# EAGLE design Atari 2600 PP (EAGLE 9.6.2)
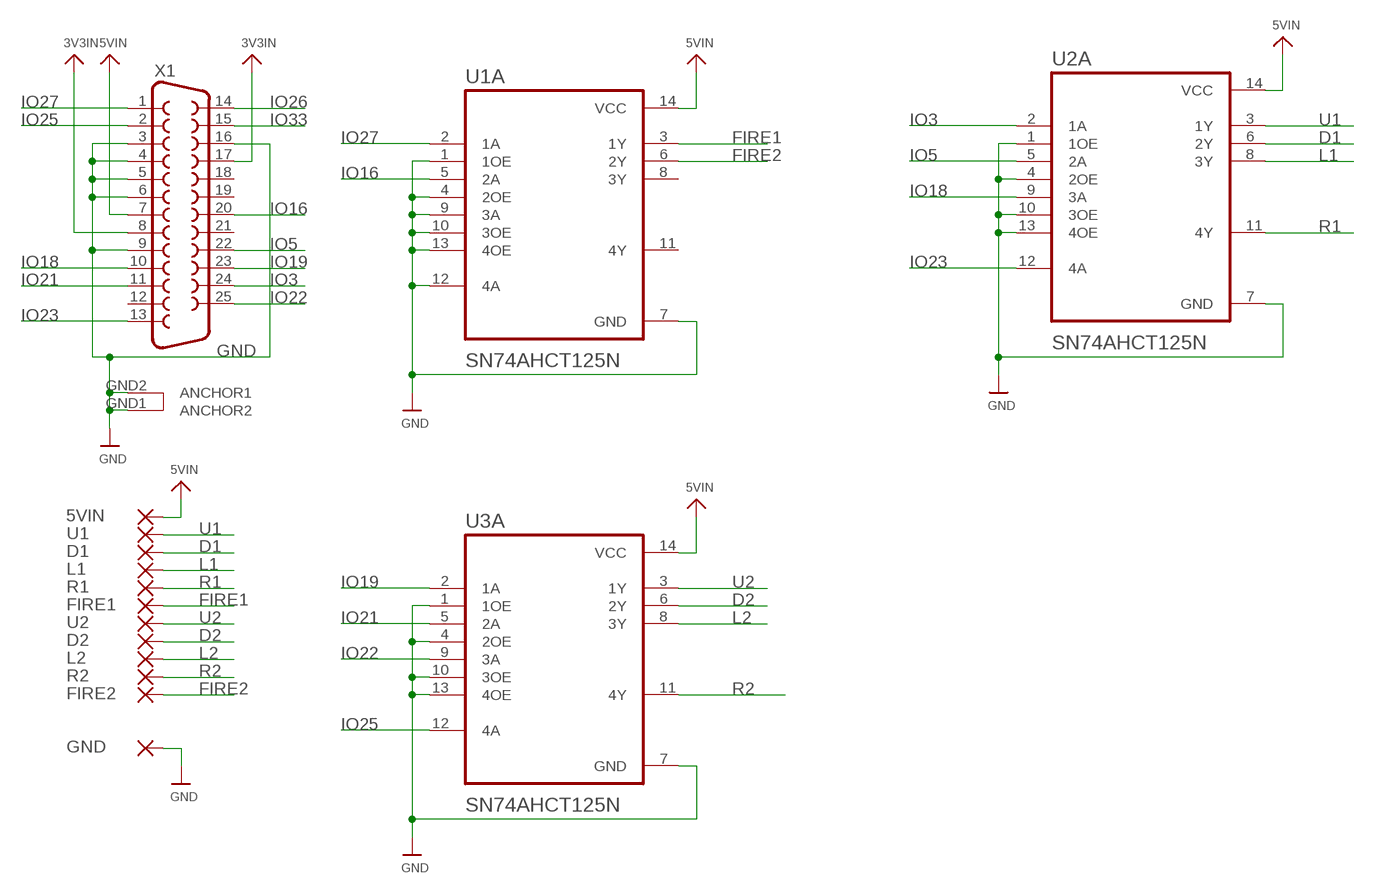
[diagram p0: schematic, sheet 1]

## Parts
5VIN  SMD5  [SMD2,54-5,08]
D1  SMD5  [SMD2,54-5,08]
D2  SMD5  [SMD2,54-5,08]
FIRE1  SMD5  [SMD2,54-5,08]
FIRE2  SMD5  [SMD2,54-5,08]
GND  SMD5  [SMD2,54-5,08]
L1  SMD5  [SMD2,54-5,08]
L2  SMD5  [SMD2,54-5,08]
R1  SMD5  [SMD2,54-5,08]
R2  SMD5  [SMD2,54-5,08]
U1  SMD5  [SMD2,54-5,08]
U1A  SN74AHCT125N  [DIP794W45P254L1969H508Q14]
U2  SMD5  [SMD2,54-5,08]
U2A  SN74AHCT125N  [DIP794W45P254L1969H508Q14]
U3A  SN74AHCT125N  [DIP794W45P254L1969H508Q14]
X1  DB25_FEMALEHP  [F25HP]

## Nets
3V3IN: X1.8 X1.17
5VIN: 5VIN.1(P) U1A.14(VCC) U2A.14(VCC) U3A.14(VCC) X1.7
D1: D1.1(P) U2A.6(2Y)
D2: D2.1(P) U3A.6(2Y)
FIRE1: FIRE1.1(P) U1A.3(1Y)
FIRE2: FIRE2.1(P) U1A.6(2Y)
GND: GND.1(P) U1A.1(1OE) U1A.4(2OE) U1A.7(GND) U1A.9(3A) U1A.10(3OE) U1A.12(4A) U1A.13(4OE) U2A.1(1OE) U2A.4(2OE) U2A.7(GND) U2A.10(3OE) U2A.13(4OE) U3A.1(1OE) U3A.4(2OE) U3A.7(GND) U3A.10(3OE) U3A.13(4OE) X1.3 X1.4 X1.5 X1.6 X1.9 X1.16 X1.GND1(ANCHOR2) X1.GND2(ANCHOR1)
IO3: U2A.2(1A) X1.24
IO5: U2A.5(2A) X1.22
IO16: U1A.5(2A) X1.20
IO18: U2A.9(3A) X1.10
IO19: U3A.2(1A) X1.23
IO21: U3A.5(2A) X1.11
IO22: U3A.9(3A) X1.25
IO23: U2A.12(4A) X1.13
IO25: U3A.12(4A) X1.2
IO26: X1.14
IO27: U1A.2(1A) X1.1
IO33: X1.15
L1: L1.1(P) U2A.8(3Y)
L2: L2.1(P) U3A.8(3Y)
R1: R1.1(P) U2A.11(4Y)
R2: R2.1(P) U3A.11(4Y)
U1: U1.1(P) U2A.3(1Y)
U2: U2.1(P) U3A.3(1Y)
Unconnected: U1A.8(3Y) U1A.11(4Y) X1.12 X1.18 X1.19 X1.21

## Library data of the parts
5VIN D1 D2 FIRE1 FIRE2 GND L1 L2 R1 R2 U1 U2 = wirepad:SMD5: SMD PAD
U1A U2A U3A = SN74AHCT125N:SN74AHCT125N: None Check prices <https://pricing.snapeda.com/parts/SN74AHCT125N/Texas%20Instruments/view-part?ref=eda>; AVAILABILITY: In Stock; DESCRIPTION: Quadruple Bus Buffer Gates With 3-State Outputs 14-PDIP -40 to 125; MF: Texas Instruments; MP: SN74AHCT125N; PACKAGE: PDIP-14 Texas Instruments; PRICE: None; PURCHASE-URL: https://pricing.snapeda.com/search/part/SN74AHCT125N/?ref=eda
X1 = SparkFun-Retired:DB25_FEMALE: 25 Pin male connector. PCB edge mount for regular PCB thicknesses. This connector will connect directly to the back of a PC parallel port or through a normal DB25 extension cable (M/F). SKU: PRT-08287

## Board
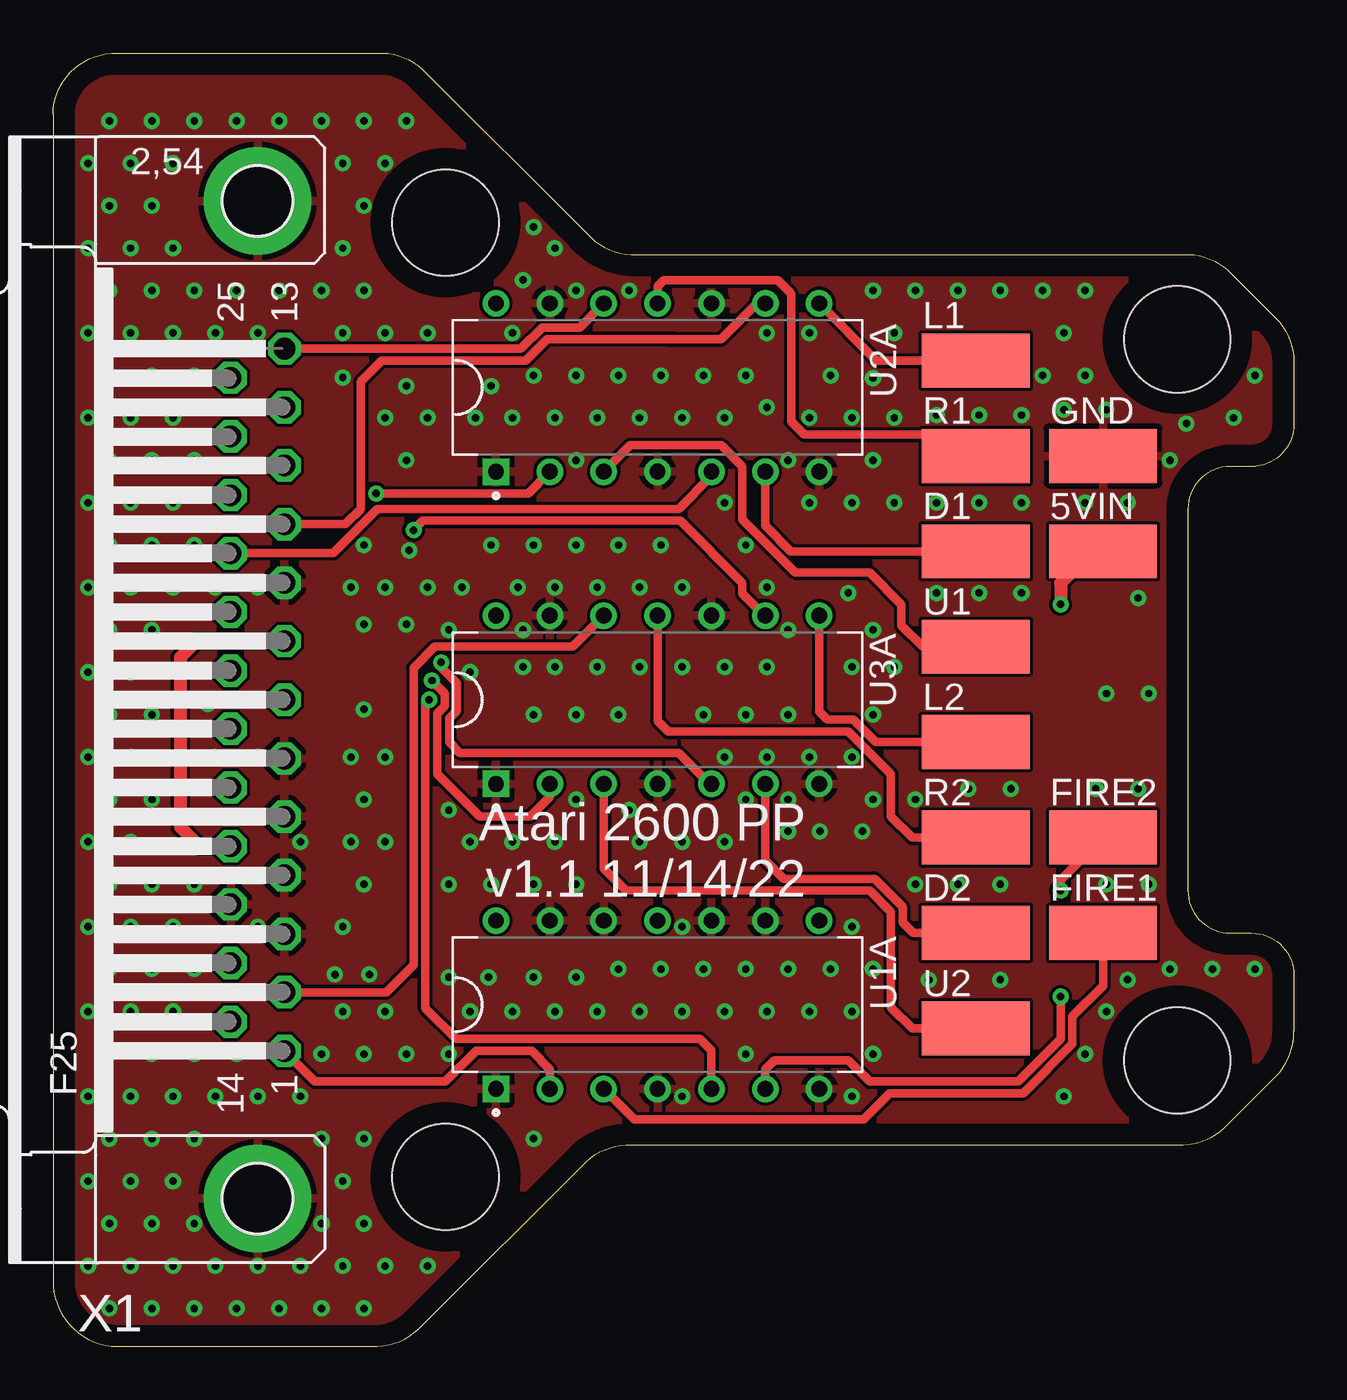
[diagram p1: board, top side]
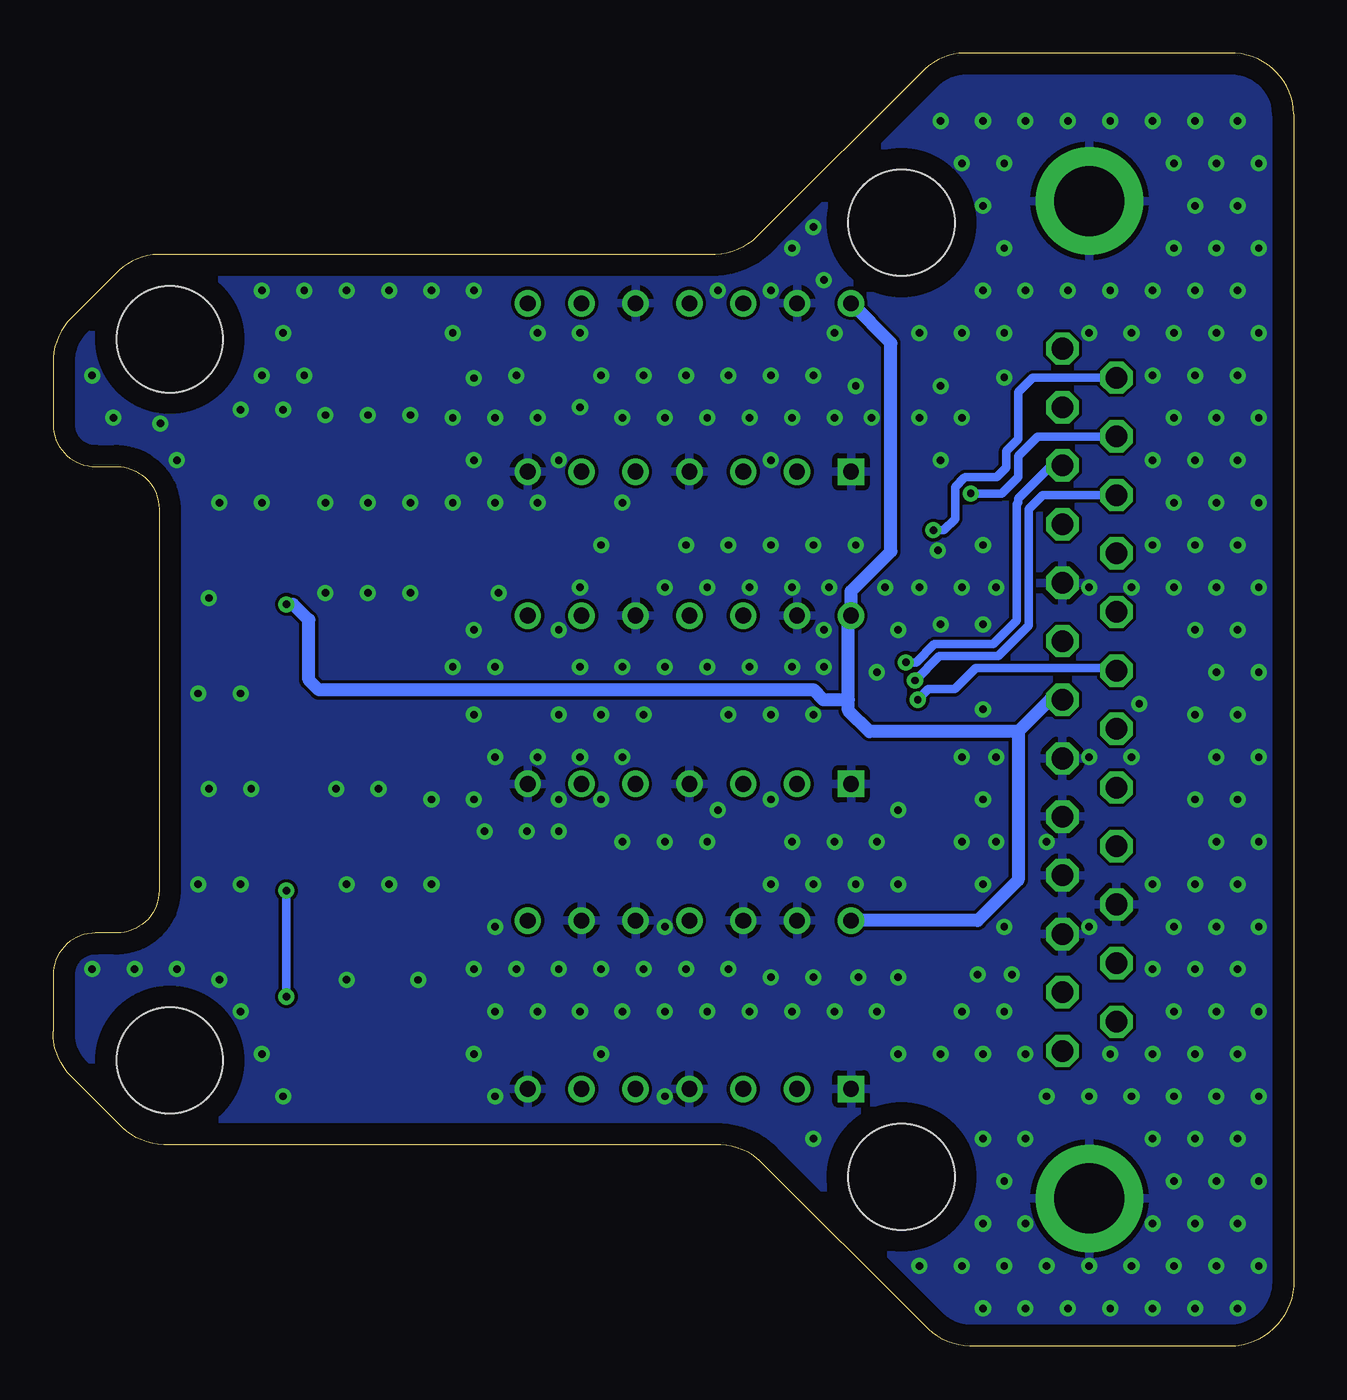
[diagram p2: board, bottom side, seen from below]

Size 58.5 x 61 mm. Coordinates in mm from the lower left corner, seen from the top.
Outline: 0,58.12 0,3.12 arc90 3.03,0 15.29,0 arc45 17.41,1 25.15,8.74 arc-45 27.27,9.5 53.29,9.5 arc45 55.41,10.5 57.65,12.74 arc45 58.5,14.86 58.5,17.5 arc90 56.5,19.5 55.5,19.5 arc-90 53.5,21.5 53.5,39.5 arc-90 55.5,41.5 56.5,41.5 arc90 58.5,43.5 58.5,46.38 arc45 57.65,48.5 55.41,50.74 arc45 53.29,51.5 27.27,51.5 arc-45 25.15,52.5 17.41,60.24 arc45 15.29,61 3.03,61 arc90 0,58.12
Copper layers (1*16): Top 0.035mm / dielectric 1.5mm / Bottom 0.035mm
Design rules "default": minimum track width 6mil, minimum drill 0.35mm, track to track 6mil, track to pad 6mil, pad to pad 6mil, via to via 6mil, smd to smd 6mil, copper to edge 40mil, drill to drill 6mil, minimum pad ring 10mil, minimum via ring 8mil, stop-mask expansion 4mil, vias tented up to drill 0.5mm, thermal gap 10mil
Holes 5 mm at 53,13.5 53,47.5 18.5,53 18.5,8

### Footprints (pad centres in the part's own frame; a part is rotated, then mirrored left to right if it is on the bottom)
SMD2,54-5,08 = smd 2.54 x 5.08: 1 0,0
DIP794W45P254L1969H508Q14 = drill 0.74 pad 1.14 square: 1 -3.97,7.62 | drill 0.74 pad 1.14: 2 -3.97,5.08; 3 -3.97,2.54; 4 -3.97,0; 5 -3.97,-2.54; 6 -3.97,-5.08; 7 -3.97,-7.62; 8 3.97,-7.62; 9 3.97,-5.08; 10 3.97,-2.54; 11 3.97,0; 12 3.97,2.54; 13 3.97,5.08; 14 3.97,7.62
F25HP = drill 1.016 octagon: 1 -16.561,-1.27; 2 -13.792,-1.27; 3 -11.049,-1.27; 4 -8.28,-1.27; 5 -5.512,-1.27; 6 -2.769,-1.27; 7 0,-1.27; 8 2.769,-1.27; 9 5.512,-1.27; 10 8.28,-1.27; 11 11.049,-1.27; 12 13.792,-1.27; 13 16.561,-1.27; 14 -15.189,1.27; 15 -12.421,1.27; 16 -9.652,1.27; 17 -6.909,1.27; 18 -4.14,1.27; 19 -1.372,1.27; 20 1.372,1.27; 21 4.14,1.27; 22 6.909,1.27; 23 9.652,1.27; 24 12.421,1.27; 25 15.189,1.27 | drill 3.302 pad 5.08: GND1 -23.52,0; GND2 23.52,0

### Placement (x,y rotation side)
5VIN  49.5,37.5 270 top
D1  43.5,37.5 270 top
D2  43.5,19.5 270 top
FIRE1  49.5,19.5 270 top
FIRE2  49.5,24 270 top
GND  49.5,42 270 top
L1  43.5,46.5 270 top
L2  43.5,28.5 270 top
R1  43.5,42 270 top
R2  43.5,24 270 top
U1  43.5,33 270 top
U1A  28.5,16.12 90 top
U2  43.5,15 270 top
U2A  28.5,45.23 90 top
U3A  28.5,30.5 90 top
X1  9.64,30.5 90 top

### Tracks (layer width: path | path; a pad name or v marks a point on that pad's centre or on a via)
3V3IN
  Top 0.61: X1.8 6.77,33.27 6,32.5 6,24.5 6.91,23.59 X1.17
5VIN  (via drill 0.35)
  Top 0.61: 5VIN.1 49,37.5 47.5,36 v47.5,35
  Bottom 0.61: X1.7 11.5,30.5 13,29 | 21,30.5 21,30 20,29 13,29 | 21,30.5 21,34.35 U3A.14 20.88,35.62 19,37.5 19,47.32 U2A.14 | U1A.14 14.91,20.09 13,22 13,29 | 21,30.5 22.18,30.5 22.64,30.96 45.96,30.96 46.44,31.44 46.44,34.26 47.18,35 v47.5,35
D1
  Top 0.406: U2A.6 33.58,38.71 34.79,37.5 D1.1
D2
  Top 0.406: U3A.6 33.58,22.92 34.44,22.06 38.73,22.06 40.06,20.73 40.06,20 40.56,19.5 D2.1
FIRE1
  Top 0.406: FIRE1.1 49.5,17 48.06,15.56 48.06,14.27 45.73,11.94 39.44,11.94 38.22,10.72 27.39,10.72 U1A.3
FIRE2  (via drill 0.35)
  Top 0.406: FIRE2.1 47.5,22 v47.5,21.5 | v47.5,16.5 47.5,14.5 45.5,12.5 38.5,12.5 37.5,13.5 34,13.5 33.58,13.08 U1A.6
  Bottom 0.406: v47.5,16.5 v47.5,21.5
GND  (via drill 0.35)
  other vias: 2.66,1.8 1.66,3.8 2.66,5.8 1.66,7.8 2.66,9.8 1.66,11.8 2.66,13.8 1.66,15.8 2.66,17.8 1.66,19.8 2.66,21.8 1.66,23.8 2.66,25.8 1.66,27.8 2.66,29.8 1.66,31.8 2.66,33.8 1.66,35.8 2.66,37.8 1.66,39.8 2.66,41.8 1.66,43.8 2.66,45.8 1.66,47.8 2.66,49.8 1.66,51.8 2.66,53.8 1.66,55.8 2.66,57.8 4.66,1.8 3.66,3.8 4.66,5.8 3.66,7.8 4.66,9.8 3.66,11.8 4.66,13.8 3.66,15.8 4.66,17.8 3.66,19.8 4.66,21.8 3.66,23.8 4.66,25.8 3.66,27.8 4.66,29.8 3.66,31.8 4.66,33.8 3.66,35.8 4.66,37.8 3.66,39.8 4.66,41.8 3.66,43.8 4.66,45.8 3.66,47.8 4.66,49.8 3.66,51.8 4.66,53.8 3.66,55.8 4.66,57.8 6.66,1.8 5.66,3.8 6.66,5.8 5.66,7.8 6.66,9.8 5.66,11.8 6.66,13.8 5.66,15.8 6.66,17.8 5.66,19.8 6.66,21.8 7.29,30.3 5.66,35.8 6.66,37.8 5.66,39.8 6.66,41.8 5.66,43.8 6.66,45.8 5.66,47.8 6.66,49.8 5.66,51.8 5.66,55.8 6.66,57.8 8.66,1.8 7.66,3.8 7.66,11.8 8.66,13.8 7.66,27.8 7.66,35.8 7.66,47.8 8.66,49.8 8.66,57.8 10.66,1.8 9.66,3.8 9.66,11.8 9.66,19.8 9.66,27.8 9.66,35.8 9.66,47.8 10.66,49.8 10.66,57.8 12.66,1.8 11.66,3.8 12.66,5.8 12.66,9.8 11.66,11.8 12.66,13.8 13.29,17.54 11.66,23.8 12.66,49.8 12.66,57.8 14.66,1.8 13.66,3.8 14.66,5.8 13.66,7.8 14.66,9.8 14.66,13.8 13.66,15.8 14.91,17.54 13.66,19.8 14.66,21.8 14.04,23.8 14.66,25.8 14.04,27.8 14.66,30.05 14.66,34.05 14.04,35.8 14.66,37.8 13.66,45.7 13.66,47.8 14.66,49.8 13.66,51.8 14.66,53.8 13.66,55.8 14.66,57.8 15.66,3.8 16.66,13.8 15.66,15.8 15.66,23.8 15.66,27.8 16.66,34.05 15.66,35.8 16.78,37.54 16.66,41.8 15.66,43.8 16.66,45.3 15.66,47.8 15.66,55.8 16.66,57.8 17.66,3.8 18.66,13.8 18.66,17.42 18.66,21.8 18.66,25.3 18.66,33.8 17.66,35.8 17.66,43.8 17.66,47.8 19.66,15.8 20.53,17.42 20.66,21.8 19.66,23.8 19.66,31.8 19.28,35.8 20.66,37.8 19.91,43.8 20.66,45.3 22.66,9.8 21.66,15.8 22.66,17.42 22.66,21.8 21.66,23.8 22.66,29.8 22.16,32.05 22.16,33.8 21.91,35.8 22.66,37.8 21.66,43.8 22.66,45.8 21.66,47.8 22.16,50.3 23.66,15.8 24.66,17.42 24.66,21.8 23.66,23.8 24.66,25.8 24.66,29.8 23.66,32.05 23.66,35.8 24.66,37.8 24.66,41.8 23.66,43.8 24.66,45.8 24.66,49.8 23.66,51.8 25.66,15.8 26.66,17.8 27.16,25.3 26.66,29.8 25.66,32.05 25.66,35.8 26.66,37.8 25.66,43.8 26.66,45.8 27.16,49.8 27.66,15.8 28.66,17.8 27.66,23.8 27.66,32.05 27.66,35.8 28.66,37.8 27.66,43.8 28.66,45.8 29.66,11.8 29.66,15.8 30.66,17.8 29.66,19.8 29.66,23.8 30.66,29.8 29.66,32.05 29.66,35.8 29.66,43.8 30.66,45.8 32.66,13.8 31.66,15.8 32.66,17.8 31.66,23.8 32.66,25.8 31.66,27.8 32.66,29.8 31.66,32.05 37.49,35.54 32.66,37.8 31.66,39.8 31.66,43.8 33.66,15.8 34.66,17.8 34.66,25.8 33.66,27.8 34.66,29.8 33.66,32.05 34.66,33.8 33.66,35.8 34.66,41.8 33.66,44.3 22.66,52.8 33.66,47.8 32.66,45.8 35.66,15.8 36.66,17.8 34.66,24.3 35.66,27.8 35.66,39.8 35.66,43.8 36.66,45.8 35.66,47.8 37.66,11.8 38.66,13.8 37.66,15.8 38.66,17.8 37.66,19.8 36.16,24.3 38.66,25.8 37.66,27.8 38.66,29.8 37.66,32.05 38.66,33.8 37.66,39.8 38.66,41.8 37.66,43.8 38.66,45.67 38.66,49.8 41.29,17.29 40.66,21.8 38.16,24.3 40.66,25.8 43.16,26.3 39.66,32.05 39.66,39.8 39.66,43.8 39.66,47.8 40.66,49.8 42.66,21.8 41.66,35.54 41.66,39.8 41.66,43.92 42.66,49.8 44.66,21.8 43.66,35.54 43.66,39.8 43.66,43.92 44.66,49.8 44.66,17.3 45.16,26.3 45.66,35.54 51.16,35.3 45.66,39.8 45.66,43.92 46.66,45.8 46.66,49.8 47.66,11.8 48.66,13.8 49.16,26.3 48.66,39.8 47.66,44.18 48.66,45.8 47.66,47.8 48.66,49.8 49.66,15.8 50.66,17.3 51.66,21.8 51.16,26.3 49.66,30.8 50.66,39.8 49.66,44.18 52.66,17.8 49.66,21.8 51.66,30.8 52.66,41.8 53.43,43.53 54.66,17.8 56.66,17.8 55.66,43.8 56.66,45.8
  pour Bottom: 0,0 0,61.12 28.53,61.12 28.53,51.62 59.03,51.62 59.03,9.5 28.03,9.5 28.03,0
  pour Top: 0,0 0,61.12 28.53,61.12 28.53,51.62 59.03,51.62 59.03,9.5 28.03,9.5 28.03,0
IO3  (via drill 0.35)
  Top 0.406: U2A.2 22.4,40.23 v15.23,40.23
  Bottom 0.406: v15.23,40.23 13.77,40.23 13,41 13,42 12.08,42.92 X1.24
IO5
  Top 0.406: X1.22 13.2,37.41 15.29,39.5 29.5,39.5 31.04,41.04 U2A.5
IO16  (via drill 0.35)
  Top 0.406: v17.73,30.5 17.56,30.32 17.56,15.94 19,14.5 30.5,14.5 31.04,13.96 U1A.5
  Bottom 0.406: v17.73,30.5 17.23,31 16,31 15,32 8.5,32 X1.20
IO18
  Top 0.406: X1.10 13.78,38.78 14.5,39.5 14.5,45.5 15.5,46.5 16.5,46.5 22.29,46.5 23.29,47.5 29,47.5 29.34,47.5 31.5,47.5 33.2,49.2 U2A.9
IO19  (via drill 0.35)
  Top 0.406: v17.86,31.41 18.47,30.8 18.47,30.2 18.12,29.85 18.12,27 20.12,25 22.5,25 23.42,25.92 U3A.2
  Bottom 0.406: v17.86,31.41 16.71,32.56 13.94,32.56 12.5,34 12.5,39.5 11.85,40.15 X1.23
IO21  (via drill 0.35)
  Top 0.406: v18.3,32.26 18.3,32.01 19.03,31.28 19.03,29.96 18.68,29.61 18.68,28.5 19.18,28 29.5,28 30.97,26.53 U3A.5
  Bottom 0.406: v18.3,32.26 17.8,32.26 16.94,33.12 14.17,33.12 13.06,34.23 13.06,39.73 13,39.79 13,40 11.45,41.55 X1.11
IO22  (via drill 0.35)
  Top 0.406: v17,38.5 17.44,38.94 29.56,38.94 32.5,36 32.5,35.5 33.53,34.47 U3A.9
  Bottom 0.406: v17,38.5 16.5,38.5 15.97,39.03 15.97,40.54 15.54,40.97 15.53,40.97 15.5,41 14,41 13.56,41.44 13.56,42.23 13,42.79 13,45 12.31,45.69 X1.25
IO23
  Top 0.406: X1.13 22.06,47.06 23.06,48.06 24.82,48.06 U2A.12
IO25
  Top 0.406: X1.2 15.71,16.71 17,18 17,32 18,33 24.49,33 U3A.12
IO27
  Top 0.406: X1.1 12.35,12.5 18.5,12.5 19.94,13.94 22.56,13.94 23.42,13.08 U1A.2
L1
  Top 0.406: U2A.8 38.82,46.5 L1.1
L2
  Top 0.406: U3A.8 36.12,29.94 36.5,29.56 37.73,29.56 38.79,28.5 L2.1
R1
  Top 0.406: U2A.11 28.5,50 28.78,50.28 34.17,50.28 34.8,49.66 34.8,43.62 35.42,43 42.5,43 R1.1
R2
  Top 0.406: U3A.11 28.5,29.5 29,29 37.5,29 39.5,27 39.5,25 40.5,24 R2.1
U1
  Top 0.406: U2A.3 27.2,42.5 31.5,42.5 32.5,41.5 32.5,39 35,36.5 38.5,36.5 40,35 40,34 41,33 U1.1
U2
  Top 0.406: U3A.3 25.96,22.54 27,21.5 38.5,21.5 39.5,20.5 39.5,16 40.5,15 U2.1

### Text on the board
tPlace: Atari 2600 PP / v1.1 11/14/22